# EAGLE design board (EAGLE 8.3.2)
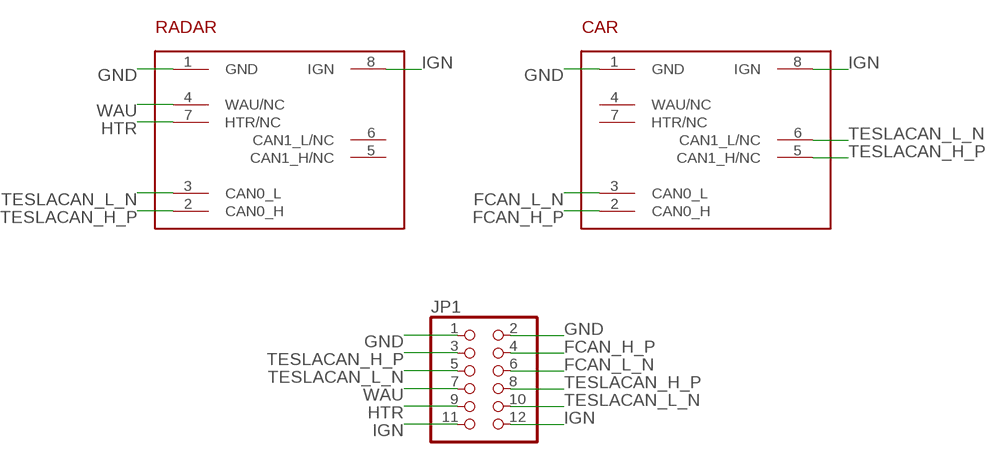
[diagram p0: schematic, sheet 1]

## Parts
CAR  TE_AMP_1-967658-1  [TE_AMP_1-967658-1]
JP1  PINHD-2X6/90  [2X06/90]
RADAR  TE_AMP_1-1534229-1TESLARADAR  [TE_AMP_1-1534229-1]

## Nets
FCAN_H_P [diff pairs]: CAR.2(CAN0_H) JP1.4
FCAN_L_N [diff pairs]: CAR.3(CAN0_L) JP1.6
GND [gnd]: CAR.1(GND) JP1.1 JP1.2 RADAR.1(GND)
HTR [hipower]: JP1.9 RADAR.7(HTR/NC)
IGN [hipower]: CAR.8(IGN) JP1.11 JP1.12 RADAR.8(IGN)
TESLACAN_H_P [diff pairs]: CAR.5(CAN1_H/NC) JP1.3 JP1.8 RADAR.2(CAN0_H)
TESLACAN_L_N [diff pairs]: CAR.6(CAN1_L/NC) JP1.5 JP1.10 RADAR.3(CAN0_L)
WAU: JP1.7 RADAR.4(WAU/NC)
Unconnected: CAR.4(WAU/NC) CAR.7(HTR/NC) RADAR.5(CAN1_H/NC) RADAR.6(CAN1_L/NC)

## Library data of the parts
CAR = Souers:TE_AMP_1-967658-1: Male portion. Mates with 1-1534229-1
JP1 = pinhead:PINHD-2X6: PIN HEADER
RADAR = Souers:TE_AMP_1-1534229-1: Used with bosch radar. Pairs with1-967658-1.

## Net classes
1 diff pairs: width 0.305 mm, clearance 0.254 mm
2 hipower: width 0.889 mm
3 gnd: width 0.406 mm

## Board
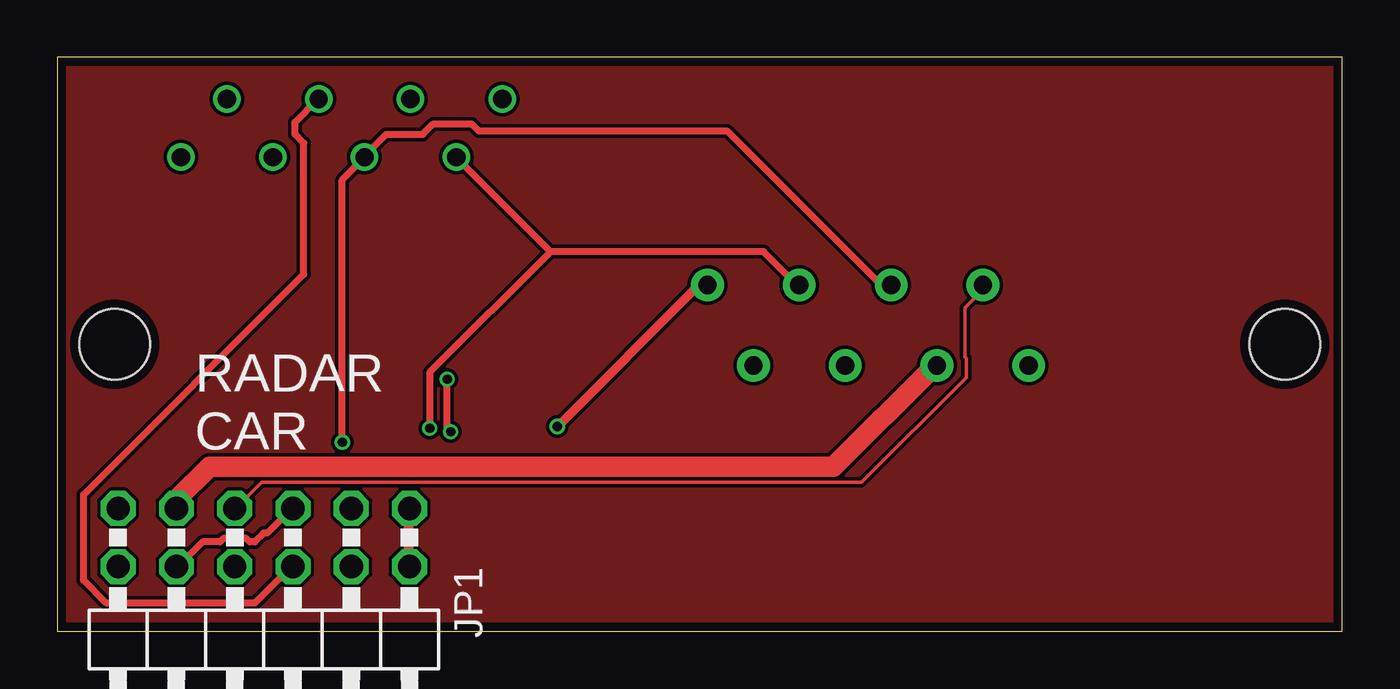
[diagram p1: board, top side]
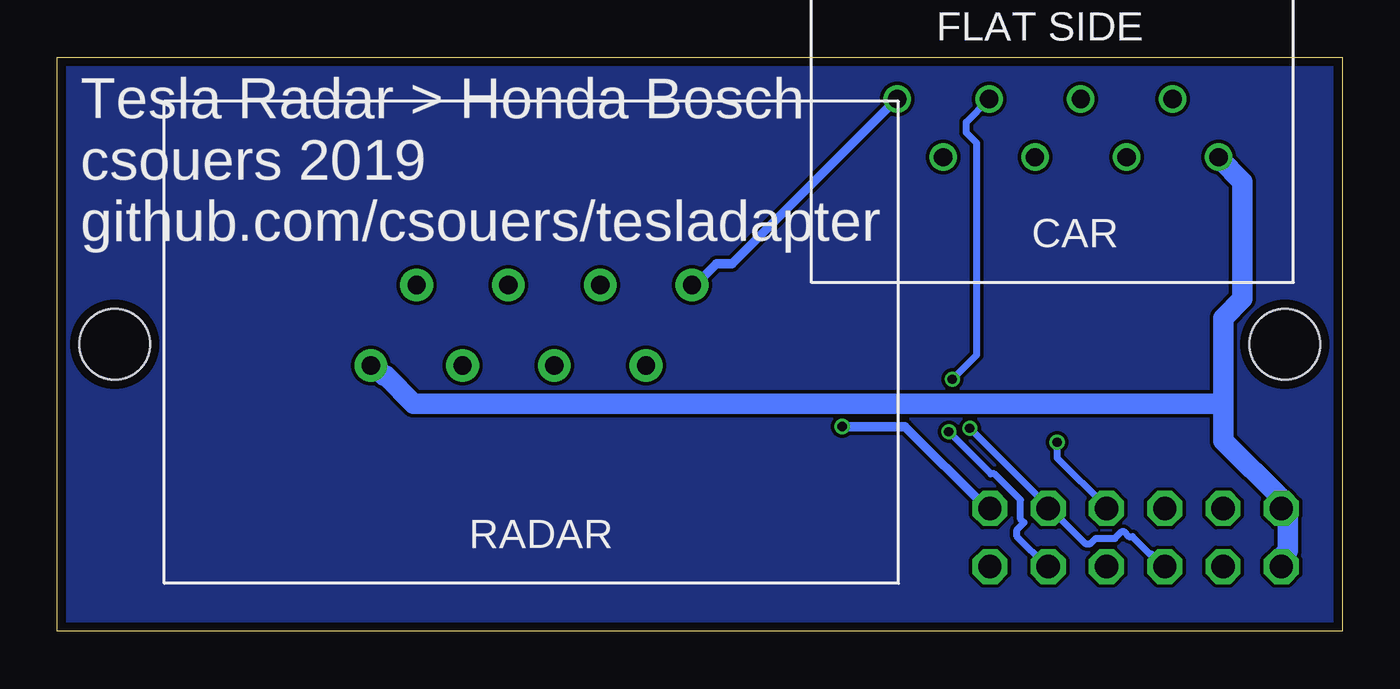
[diagram p2: board, bottom side, seen from below]

Size 56 x 25 mm. Coordinates in mm from the lower left corner, seen from the top.
Outline: 0,0 56,0 56,25 0,25 0,0
Copper layers (1*16): Top 0.035559375mm / dielectric 1.6mm / Bottom 0.035559375mm
Design rules "oshpark-2layer *": minimum track width 6mil, minimum drill 16mil, track to track 6mil, track to pad 6mil, pad to pad 6mil, via to via 6mil, smd to smd 6mil, copper to edge 15mil, drill to drill 6mil, minimum pad ring 5mil, minimum via ring 5mil, stop-mask expansion 2.5mil, vias tented up to drill 0mil, thermal gap 10mil
Holes 3.1 mm at 2.5,12.5 53.5,12.5

### Footprints (pad centres in the part's own frame; a part is rotated, then mirrored left to right if it is on the bottom)
TE_AMP_1-967658-1 = drill 0.8: 1 12,0; 2 8,0; 3 4,0; 4 0,0; 5 10,2.54; 6 6,2.54; 7 2,2.54; 8 -2,2.54
2X06/90 = drill 1.016 octagon: 1 -6.35,-6.35; 2 -6.35,-3.81; 3 -3.81,-6.35; 4 -3.81,-3.81; 5 -1.27,-6.35; 6 -1.27,-3.81; 7 1.27,-6.35; 8 1.27,-3.81; 9 3.81,-6.35; 10 3.81,-3.81; 11 6.35,-6.35; 12 6.35,-3.81
TE_AMP_1-1534229-1 = drill 0.8 pad 1.422: 1 -8,0; 2 -4,0; 3 0,0; 4 4,0; 5 -6,3.5; 6 -2,3.5; 7 2,3.5; 8 6,3.5

### Placement (x,y rotation side)
CAR  7.39,23.19 180 bottom
JP1  9,-1 180 top
RADAR  36.34,15.08 180 bottom

### Tracks (layer width: path | path; a pad name or v marks a point on that pad's centre or on a via)
FCAN_H_P  (via drill 0.41)
  Top 0.305: v16.99,10.97 16.99,8.84 v17.14,8.69
  Bottom 0.305: v16.99,10.97 15.93,12.04 15.93,21.26 16.38,21.72 16.38,22.17 15.39,23.16 CAR.2 | v17.14,8.69 15.32,6.86 15.16,6.86 14.02,5.71 14.02,4.88 13.87,4.72 14.17,4.42 14.17,4.12 12.88,2.82 JP1.4
FCAN_L_N
  Top 0.305: CAR.3 11.35,23.16 10.36,22.17 10.36,21.64 10.74,21.26 10.74,15.54 1.14,5.94 1.14,2.21 2.13,1.22 8.61,1.22 10.21,2.82 JP1.6
GND  (via drill 0.41)
  Top 0.406: JP1.2 15.32,2.82 15.32,5.33 JP1.1 | v21.79,8.91 27.89,15.01 28.27,15.01 RADAR.1
  Bottom 0.406: CAR.1 19.43,23.16 26.59,16 27.28,16 28.27,15.01 RADAR.1 | v21.79,8.91 19.05,8.91 15.54,5.41 15.39,5.41 JP1.1
HTR
  Top 0.889: RADAR.7 38.33,11.51 38.18,11.51 33.83,7.16 6.63,7.16 5.18,5.71 5.18,5.41 JP1.9
IGN
  Bottom 0.889: 5.18,9.91 5.18,8.31 2.59,5.71 2.59,5.41 JP1.11 2.44,4.95 2.36,4.88 2.36,3.5 2.67,3.2 2.67,2.82 JP1.12 | 5.18,9.91 5.18,13.64 4.34,14.48 4.34,19.58 5.33,20.57 CAR.8 | 5.18,9.91 40.46,9.91 41.68,11.12 41.76,11.12 42.14,11.51 42.29,11.51 RADAR.8
N$1
  pour Top: 56,0.1 56,25 0.1,25 0.1,0.1
  pour Bottom: 56,0.1 56,25 0.1,25 0.1,0.1
TESLACAN_H_P  (via drill 0.41)
  Top 0.305: 21.49,16.54 17.45,20.57 CAR.5 | 21.49,16.54 30.79,16.54 32.31,15.01 RADAR.2 | v16.23,8.84 16.23,11.28 21.49,16.54
  Bottom 0.305: JP1.8 7.77,2.82 8.31,3.35 8.38,3.35 9.14,4.12 9.3,4.12 9.53,4.34 9.6,4.34 9.91,4.04 10.74,4.04 10.97,3.81 11.2,3.81 12.8,5.41 JP1.3 12.88,5.49 v16.23,8.84
TESLACAN_L_N  (via drill 0.41)
  Top 0.305: v12.42,8.23 12.42,19.66 13.34,20.57 CAR.6 13.41,20.73 14.33,21.64 15.93,21.64 16.38,22.1 18.06,22.1 18.36,21.79 29.18,21.79 35.89,15.09 36.27,15.09 RADAR.3 | JP1.10 5.26,2.82 6.33,3.89 7.09,3.89 7.24,4.04 8.23,4.04 8.38,3.89 8.61,3.89 8.99,4.27 9.14,4.27 10.21,5.33 JP1.5
  Bottom 0.305: v12.42,8.23 12.42,7.54 10.29,5.41 JP1.5
WAU
  Top 0.152: RADAR.4 40.31,15.01 40.31,14.86 39.55,14.1 39.55,11.96 39.62,11.89 39.62,11.05 35.05,6.48 8.91,6.48 7.77,5.33 JP1.7

### Text on the board
tPlace: RADAR / CAR
bPlace: Tesla Radar > Honda Bosch / csouers 2019 / github.com/csouers/tesladapter